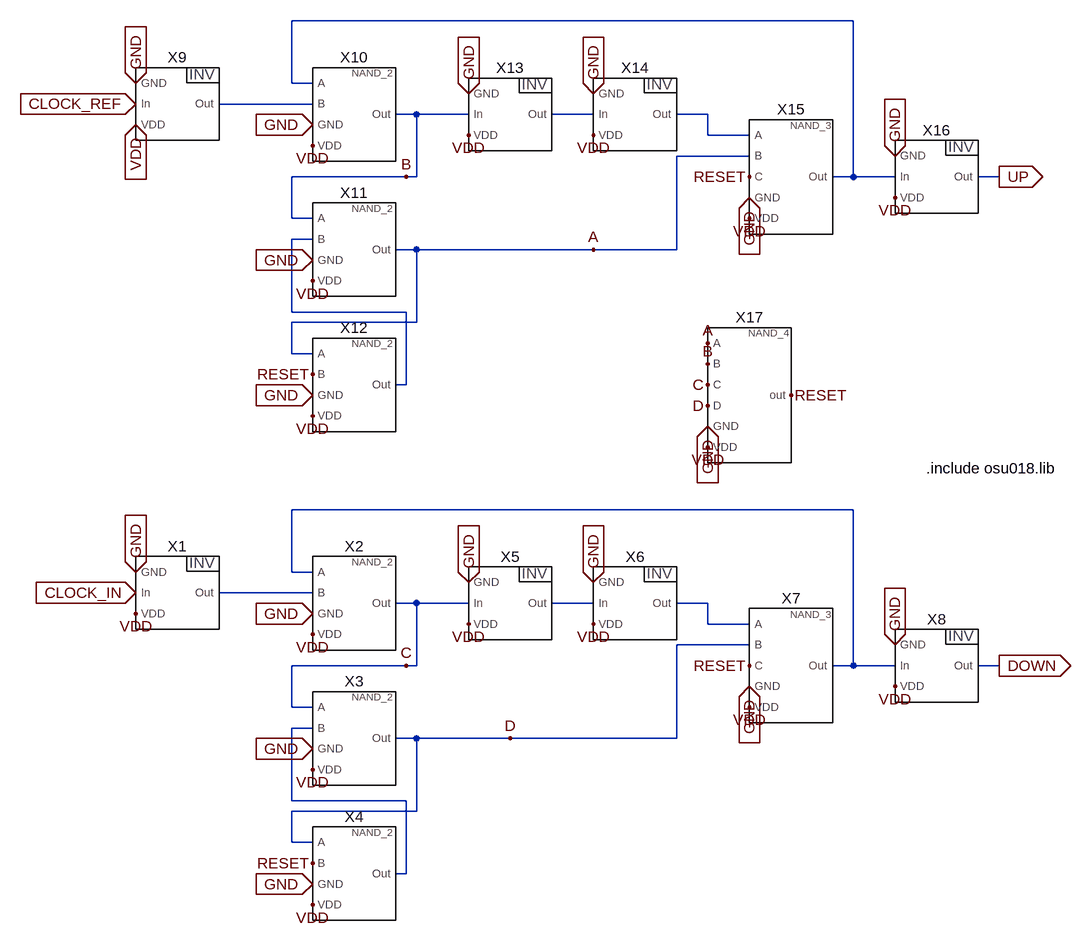
[diagram p0: schematic Z_PDF.asc]
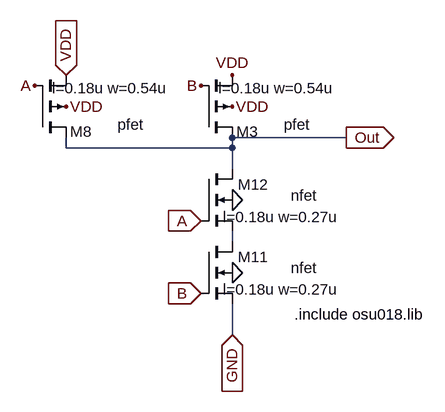
[diagram p1: sub-circuit nand_2.asc]
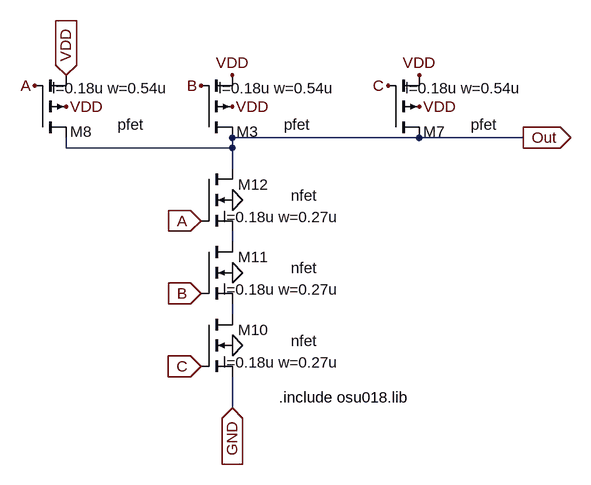
[diagram p2: sub-circuit nand_3.asc]
Z_PDF.asc, the LTspice schematic file:
Version 4
SHEET 1 2360 680
WIRE 1040 -784 176 -784
WIRE 176 -688 176 -784
WIRE 208 -688 176 -688
WIRE 208 -656 64 -656
WIRE 368 -640 336 -640
WIRE 448 -640 368 -640
WIRE 640 -640 576 -640
WIRE 816 -640 768 -640
WIRE 816 -608 816 -640
WIRE 880 -608 816 -608
WIRE 880 -576 768 -576
WIRE 352 -544 176 -544
WIRE 368 -544 368 -640
WIRE 368 -544 352 -544
WIRE 1040 -544 1040 -784
WIRE 1040 -544 1008 -544
WIRE 1104 -544 1040 -544
WIRE 1264 -544 1232 -544
WIRE 176 -480 176 -544
WIRE 208 -480 176 -480
WIRE 208 -448 176 -448
WIRE 368 -432 336 -432
WIRE 640 -432 368 -432
WIRE 768 -432 768 -576
WIRE 768 -432 640 -432
WIRE 176 -336 176 -448
WIRE 352 -336 176 -336
WIRE 368 -320 368 -432
WIRE 368 -320 176 -320
WIRE 176 -272 176 -320
WIRE 208 -272 176 -272
WIRE 352 -224 352 -336
WIRE 352 -224 336 -224
WIRE 1040 -32 176 -32
WIRE 176 64 176 -32
WIRE 208 64 176 64
WIRE 208 96 64 96
WIRE 368 112 336 112
WIRE 448 112 368 112
WIRE 640 112 576 112
WIRE 816 112 768 112
WIRE 816 144 816 112
WIRE 880 144 816 144
WIRE 880 176 768 176
WIRE 352 208 176 208
WIRE 368 208 368 112
WIRE 368 208 352 208
WIRE 1040 208 1040 -32
WIRE 1040 208 1008 208
WIRE 1104 208 1040 208
WIRE 1264 208 1232 208
WIRE 176 272 176 208
WIRE 208 272 176 272
WIRE 208 304 176 304
WIRE 368 320 336 320
WIRE 512 320 368 320
WIRE 768 320 768 176
WIRE 768 320 512 320
WIRE 176 416 176 304
WIRE 352 416 176 416
WIRE 368 432 368 320
WIRE 368 432 176 432
WIRE 176 480 176 432
WIRE 208 480 176 480
WIRE 352 528 352 416
WIRE 352 528 336 528
FLAG -64 96 CLOCK_IN
IOPIN -64 96 In
FLAG -64 128 VDD
FLAG 208 160 VDD
FLAG 208 368 VDD
FLAG 208 576 VDD
FLAG 208 512 RESET
FLAG 448 144 VDD
FLAG 640 144 VDD
FLAG 880 208 RESET
FLAG 880 272 VDD
FLAG 1104 240 VDD
FLAG 1264 208 DOWN
IOPIN 1264 208 Out
FLAG -64 -656 CLOCK_REF
IOPIN -64 -656 In
FLAG -64 -624 VDD
IOPIN -64 -624 In
FLAG 208 -592 VDD
FLAG 208 -384 VDD
FLAG 208 -176 VDD
FLAG 208 -240 RESET
FLAG 448 -608 VDD
FLAG 640 -608 VDD
FLAG 880 -544 RESET
FLAG 880 -480 VDD
FLAG 1104 -512 VDD
FLAG 1264 -544 UP
IOPIN 1264 -544 Out
FLAG 816 -128 VDD
FLAG 816 -288 A
FLAG 816 -256 B
FLAG 816 -224 C
FLAG 816 -192 D
FLAG 640 -432 A
FLAG 352 -544 B
FLAG 352 208 C
FLAG 512 320 D
FLAG 944 -208 RESET
FLAG 816 -160 GND
IOPIN 816 -160 In
FLAG 208 128 GND
IOPIN 208 128 In
FLAG 448 80 GND
IOPIN 448 80 In
FLAG 640 80 GND
IOPIN 640 80 In
FLAG 880 240 GND
IOPIN 880 240 In
FLAG 208 -208 GND
IOPIN 208 -208 In
FLAG 208 -416 GND
IOPIN 208 -416 In
FLAG -64 64 GND
IOPIN -64 64 In
FLAG 208 336 GND
IOPIN 208 336 In
FLAG 208 544 GND
IOPIN 208 544 In
FLAG 1104 176 GND
IOPIN 1104 176 In
FLAG 880 -512 GND
IOPIN 880 -512 In
FLAG 1104 -576 GND
IOPIN 1104 -576 In
FLAG 640 -672 GND
IOPIN 640 -672 In
FLAG 448 -672 GND
IOPIN 448 -672 In
FLAG 208 -624 GND
IOPIN 208 -624 In
FLAG -64 -688 GND
IOPIN -64 -688 In
SYMBOL INV_1 0 96 R0
SYMATTR InstName X1
SYMBOL NAND_2 272 112 R0
SYMATTR InstName X2
SYMBOL NAND_2 272 320 R0
SYMATTR InstName X3
SYMBOL NAND_2 272 528 R0
SYMATTR InstName X4
SYMBOL INV_1 512 112 R0
SYMATTR InstName X5
SYMBOL INV_1 704 112 R0
SYMATTR InstName X6
SYMBOL NAND_3 944 208 R0
SYMATTR InstName X7
SYMBOL INV_1 1168 208 R0
SYMATTR InstName X8
SYMBOL INV_1 0 -656 R0
SYMATTR InstName X9
SYMBOL NAND_2 272 -640 R0
SYMATTR InstName X10
SYMBOL NAND_2 272 -432 R0
SYMATTR InstName X11
SYMBOL NAND_2 272 -224 R0
SYMATTR InstName X12
SYMBOL INV_1 512 -640 R0
SYMATTR InstName X13
SYMBOL INV_1 704 -640 R0
SYMATTR InstName X14
SYMBOL NAND_3 944 -544 R0
SYMATTR InstName X15
SYMBOL INV_1 1168 -544 R0
SYMATTR InstName X16
SYMBOL NAND_4 880 -208 R0
SYMATTR InstName X17
TEXT 1152 -96 Left 2 !.include osu018.lib

nand_2.asc, the sub-circuit schematic file:
Version 4
SHEET 1 6288 680
WIRE 1344 -416 1168 -416
WIRE 912 -400 912 -416
WIRE 1168 -400 1168 -416
WIRE 1168 -400 912 -400
WIRE 1168 -368 1168 -400
WIRE 1168 -256 1168 -272
WIRE 1168 -112 1168 -160
FLAG 1168 -464 VDD
FLAG 912 -464 VDD
FLAG 1168 -208 0
FLAG 1168 -320 0
FLAG 1168 -512 VDD
FLAG 912 -512 VDD
IOPIN 912 -512 In
FLAG 1168 -112 GND
IOPIN 1168 -112 In
FLAG 1344 -416 Out
IOPIN 1344 -416 Out
FLAG 864 -496 A
FLAG 1120 -288 A
IOPIN 1120 -288 In
FLAG 1120 -496 B
FLAG 1120 -176 B
IOPIN 1120 -176 In
SYMBOL pmos4 1120 -416 M180
WINDOW 0 88 9 Right 2
WINDOW 3 168 20 Right 2
WINDOW 123 206 76 Right 2
SYMATTR InstName M3
SYMATTR Value pfet
SYMATTR Value2 l=0.18u w=0.54u
SYMBOL pmos4 864 -416 M180
WINDOW 0 88 9 Right 2
WINDOW 3 168 20 Right 2
WINDOW 123 206 76 Right 2
SYMATTR InstName M8
SYMATTR Value pfet
SYMATTR Value2 l=0.18u w=0.54u
SYMBOL nmos4 1120 -256 R0
WINDOW 0 104 24 Right 2
WINDOW 3 179 41 Right 2
WINDOW 123 213 74 Right 2
SYMATTR InstName M11
SYMATTR Value nfet
SYMATTR Value2 l=0.18u w=0.27u
SYMBOL nmos4 1120 -368 R0
WINDOW 0 104 24 Right 2
WINDOW 3 179 41 Right 2
WINDOW 123 213 74 Right 2
SYMATTR InstName M12
SYMATTR Value nfet
SYMATTR Value2 l=0.18u w=0.27u
TEXT 1264 -144 Left 2 !.include osu018.lib

nand_3.asc, the sub-circuit schematic file:
Version 4
SHEET 1 6288 680
WIRE 1456 -416 1168 -416
WIRE 1616 -416 1456 -416
WIRE 912 -400 912 -416
WIRE 1168 -400 1168 -416
WIRE 1168 -400 912 -400
WIRE 1168 -368 1168 -400
WIRE 1168 -256 1168 -272
WIRE 1168 -144 1168 -160
WIRE 1168 0 1168 -48
FLAG 1168 -464 VDD
FLAG 1456 -464 VDD
FLAG 912 -464 VDD
FLAG 1168 -96 0
FLAG 1168 -208 0
FLAG 1168 -320 0
FLAG 1168 -512 VDD
FLAG 1456 -512 VDD
FLAG 912 -512 VDD
IOPIN 912 -512 In
FLAG 1168 0 GND
IOPIN 1168 0 In
FLAG 1616 -416 Out
IOPIN 1616 -416 Out
FLAG 864 -496 A
FLAG 1120 -288 A
IOPIN 1120 -288 In
FLAG 1120 -496 B
FLAG 1120 -176 B
IOPIN 1120 -176 In
FLAG 1408 -496 C
FLAG 1120 -64 C
IOPIN 1120 -64 In
SYMBOL pmos4 1120 -416 M180
WINDOW 0 88 9 Right 2
WINDOW 3 168 20 Right 2
WINDOW 123 206 76 Right 2
SYMATTR InstName M3
SYMATTR Value pfet
SYMATTR Value2 l=0.18u w=0.54u
SYMBOL pmos4 1408 -416 M180
WINDOW 0 88 9 Right 2
WINDOW 3 168 20 Right 2
WINDOW 123 206 76 Right 2
SYMATTR InstName M7
SYMATTR Value pfet
SYMATTR Value2 l=0.18u w=0.54u
SYMBOL pmos4 864 -416 M180
WINDOW 0 88 9 Right 2
WINDOW 3 168 20 Right 2
WINDOW 123 206 76 Right 2
SYMATTR InstName M8
SYMATTR Value pfet
SYMATTR Value2 l=0.18u w=0.54u
SYMBOL nmos4 1120 -144 R0
WINDOW 0 104 24 Right 2
WINDOW 3 179 41 Right 2
WINDOW 123 213 74 Right 2
SYMATTR InstName M10
SYMATTR Value nfet
SYMATTR Value2 l=0.18u w=0.27u
SYMBOL nmos4 1120 -256 R0
WINDOW 0 104 24 Right 2
WINDOW 3 179 41 Right 2
WINDOW 123 213 74 Right 2
SYMATTR InstName M11
SYMATTR Value nfet
SYMATTR Value2 l=0.18u w=0.27u
SYMBOL nmos4 1120 -368 R0
WINDOW 0 104 24 Right 2
WINDOW 3 179 41 Right 2
WINDOW 123 213 74 Right 2
SYMATTR InstName M12
SYMATTR Value nfet
SYMATTR Value2 l=0.18u w=0.27u
TEXT 1240 -16 Left 2 !.include osu018.lib

The netlist it stands for:
* Z_PDF.asc
XX1 GND CLOCK_IN VDD N007 INV_1  ; pins GND In VDD Out
XX2 N006 N007 GND VDD C nand_2
XX3 C N010 GND VDD D nand_2
XX4 D RESET GND VDD N010 nand_2
XX5 GND C VDD N008 INV_1  ; pins GND In VDD Out
XX6 GND N008 VDD N009 INV_1  ; pins GND In VDD Out
XX7 N009 D RESET GND VDD N006 nand_3
XX8 GND N006 VDD DOWN INV_1  ; pins GND In VDD Out
XX9 GND CLOCK_REF VDD N002 INV_1  ; pins GND In VDD Out
XX10 N001 N002 GND VDD B nand_2
XX11 B N005 GND VDD A nand_2
XX12 A RESET GND VDD N005 nand_2
XX13 GND B VDD N003 INV_1  ; pins GND In VDD Out
XX14 GND N003 VDD N004 INV_1  ; pins GND In VDD Out
XX15 N004 A RESET GND VDD N001 nand_3
XX16 GND N001 VDD UP INV_1  ; pins GND In VDD Out
XX17 A B C D GND VDD RESET NAND_4  ; pins A B C D GND VDD out

* block symbol definitions
.subckt nand_2 A B GND VDD Out
M3 Out B VDD VDD pfet l=0.18u w=0.54u
M8 Out A VDD VDD pfet l=0.18u w=0.54u
M11 N001 B GND 0 nfet l=0.18u w=0.27u
M12 Out A N001 0 nfet l=0.18u w=0.27u
.include osu018.lib
.ends nand_2

.subckt nand_3 A B C GND VDD Out
M3 Out B VDD VDD pfet l=0.18u w=0.54u
M7 Out C VDD VDD pfet l=0.18u w=0.54u
M8 Out A VDD VDD pfet l=0.18u w=0.54u
M10 N002 C GND 0 nfet l=0.18u w=0.27u
M11 N001 B N002 0 nfet l=0.18u w=0.27u
M12 Out A N001 0 nfet l=0.18u w=0.27u
.include osu018.lib
.ends nand_3

.model NMOS NMOS
.model PMOS PMOS
.lib standard.mos
.include osu018.lib
.backanno
.end